# EAGLE schematic MiniD1 Schema (EAGLE 9.5.1)
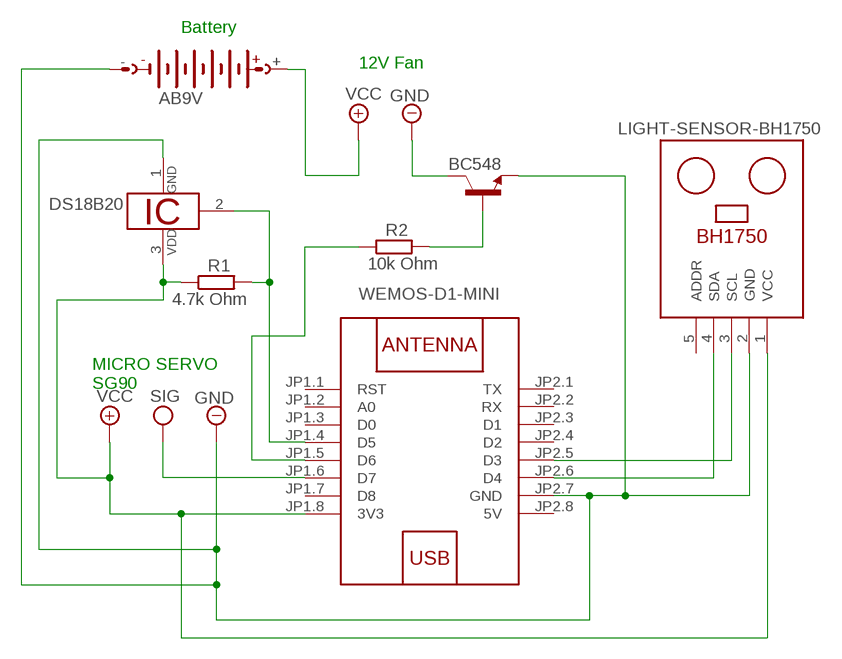
[diagram p0: schematic, sheet 1]

## Parts
G1  AB9V  [AB9V]
IC1  DS18B20  [TO92-]
Q1  BC548  [TO92-EBC]
R1  4.7k Ohm  R-EU_0207/10  [0207/10]
R2  10k Ohm  R-EU_0207/10  [0207/10]
U$1  WEMOS-D1-MINI  [WEMOS-D1-MINI]
U$2  LIGHT-SENSOR-BH1750  [LIGHT-SENSOR-BH1750]

## Nets
+5V: G1.+ IC1.3 R1.1 U$1.JP1.8(3V3) U$2.1(VCC) ; supply symbol labelled VCC
-5V: G1.- IC1.1 Q1.C Q1.E U$1.JP2.7(GND) U$2.2(GND) ; supply symbol labelled GND
N$1: U$1.JP2.6(D4) U$2.4(SDA)
N$2: U$1.JP2.5(D3) U$2.3(SCL)
N$3: R2.1 U$1.JP1.5(D6)
N$4: IC1.2 R1.2 U$1.JP1.4(D5)
N$5: Q1.B R2.2
VDD: U$1.JP1.6(D7) ; supply symbol labelled SIG
Unconnected: U$1.JP1.1(RST) U$1.JP1.2(A0) U$1.JP1.3(D0) U$1.JP1.7(D8) U$1.JP2.1(TX) U$1.JP2.2(RX) U$1.JP2.3(D1) U$1.JP2.4(D2) U$2.5(ADDR)

## Notes on the sheet
- Battery
- 12V Fan
- MICRO SERVO
  SG90

## Power pins joined to a net without a drawn wire
5V: U$1.JP2.8(5V)

## Library data of the parts
G1 = battery:AB9V: 9-V BATTERY CLIP
IC1 = 1wire:DS18B20: Programmable Resolution Digital Thermometer This chip provides a onewire thermosensor with approx. 0.5°C accuracy. A programmable over/undertemperure alarm is available. The precision can be set from 9..12 bits. Notes: Vdd must be applied for accurate measurements at low temperatures, as the parasite power circuit otherwise heats the sensor. If parasite power is used, Vdd has to be connected to GND. The DS1822 is a low-cost thermometer chip, the DS18S20 is similar to the DS18B20, but with 9 Bit precision only. Author: Jan Kandziora <jjj@gmx.de>
Q1 = transistor-npn:BC548*: NPN Transistor
R1 R2 = rcl:R-EU_: RESISTOR, European symbol; SPICEPREFIX: R
U$1 = diy-modules:WEMOS-D1-MINI: WEMOS D1 mini: Mini Wi-Fi Board based on ESP-8266 device More details can be found here: https://www.wemos.cc/product/d1-mini.html Click here to find device on ebay.com <http://www.ebay.com/sch/wemos+d1+mini+nodemcu>
U$2 = diy-modules:LIGHT-SENSOR-BH1750: Digital Light Sensor based on BH1750 BH1750 datasheet is available here: http://www.mouser.com/ds/2/348/bh1750fvi-e-186247.pdf Arduino Library for BH1750 is available here: https://github.com/claws/BH1750 Video Tutorial is available here: https://www.youtube.com/watch?v=UsLcHSbxf_8 Click here to find device on ebay.com <http://www.ebay.com/sch/bh1750fvi+module> Note: There are many variants. Search for the proper version.